# EAGLE design Stress Wheat bridge board (EAGLE 9.6.2)
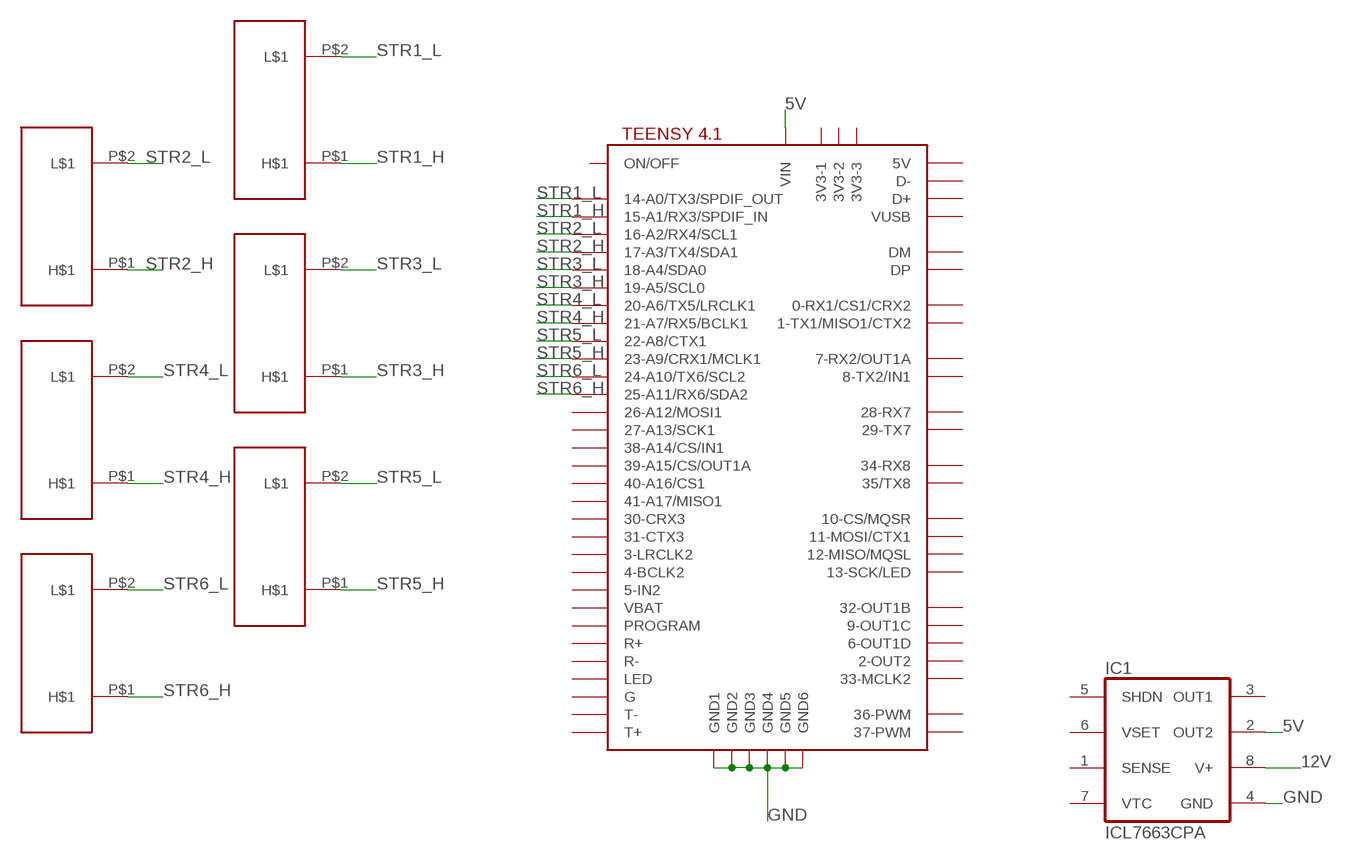
[diagram p0: schematic, sheet 1]

## Parts
IC1  ICL7663CPA  [DIL08]
U$1  STR_GAUGE  [STR_GAUGE]
U$2  STR_GAUGE  [STR_GAUGE]
U$3  TEENSY41  [TEENSY41]
U$4  STR_GAUGE  [STR_GAUGE]
U$5  STR_GAUGE  [STR_GAUGE]
U$6  STR_GAUGE  [STR_GAUGE]
U$7  STR_GAUGE  [STR_GAUGE]

## Nets
5V: IC1.2(OUT2) U$3.VIN
12V: IC1.8(V+)
GND: IC1.4(GND) U$3.GND1 U$3.GND2 U$3.GND3 U$3.GND4 U$3.GND5 U$3.GND6
STR1_H: U$1.P$1(H$1) U$3.15-A1/RX3/SPDIF_IN
STR1_L: U$1.P$2(L$1) U$3.14-A0/TX3/SPDIF_OUT
STR2_H: U$2.P$1(H$1) U$3.17-A3/TX4/SDA1
STR2_L: U$2.P$2(L$1) U$3.16-A2/RX4/SCL1
STR3_H: U$3.19-A5/SCL0 U$4.P$1(H$1)
STR3_L: U$3.18-A4/SDA0 U$4.P$2(L$1)
STR4_H: U$3.21-A7/RX5/BCLK1 U$5.P$1(H$1)
STR4_L: U$3.20-A6/TX5/LRCLK1 U$5.P$2(L$1)
STR5_H: U$3.23-A9/CRX1/MCLK1 U$6.P$1(H$1)
STR5_L: U$3.22-A8/CTX1 U$6.P$2(L$1)
STR6_H: U$3.25-A11/RX6/SDA2 U$7.P$1(H$1)
STR6_L: U$3.24-A10/TX6/SCL2 U$7.P$2(L$1)
Unconnected: IC1.1(SENSE) IC1.3(OUT1) IC1.5(SHDN) IC1.6(VSET) IC1.7(VTC) U$3.0-RX1/CS1/CRX2 U$3.1-TX1/MISO1/CTX2 U$3.2-OUT2 U$3.3-LRCLK2 U$3.3V3-1 U$3.3V3-2 U$3.3V3-3 U$3.4-BCLK2 U$3.5-IN2 U$3.6-OUT1D U$3.7-RX2/OUT1A U$3.8-TX2/IN2(8-TX2/IN1) U$3.9-OUT1C U$3.10-CS\MQSR(10-CS/MQSR) U$3.11-MOSI/CTX1 U$3.12-MISO/MQSL U$3.13-SCK/LED U$3.26-A12/MOSI1 U$3.27-A13/SCK1 U$3.28-RX7 U$3.29-TX7 U$3.30-CRX3 U$3.31-CTX3 U$3.32-OUT1B U$3.33-MCLK2 U$3.34-RX8 U$3.35-TX8(35/TX8) U$3.36-PWM U$3.37-PWM U$3.38-A14/CS/IN1 U$3.39-A15/CS/OUT1A U$3.40-A16/CS1 U$3.41-A17/MISO1 U$3.+5V(5V) U$3.D+ U$3.D- U$3.DM U$3.DP U$3.G U$3.LED U$3.ON/OFF U$3.PROGRAM U$3.R+ U$3.R- U$3.T+ U$3.T- U$3.VBAT U$3.VUSB

## Library data of the parts
IC1 = maxim:ICL7663CPA: Positive VOLTAGE REGULATOR; OC_FARNELL: unknown; OC_NEWARK: unknown
U$1 U$2 U$4-U$7 = F-E library custom components:STR_GAUGE
U$3 = teensy:TEENSY41

## Board
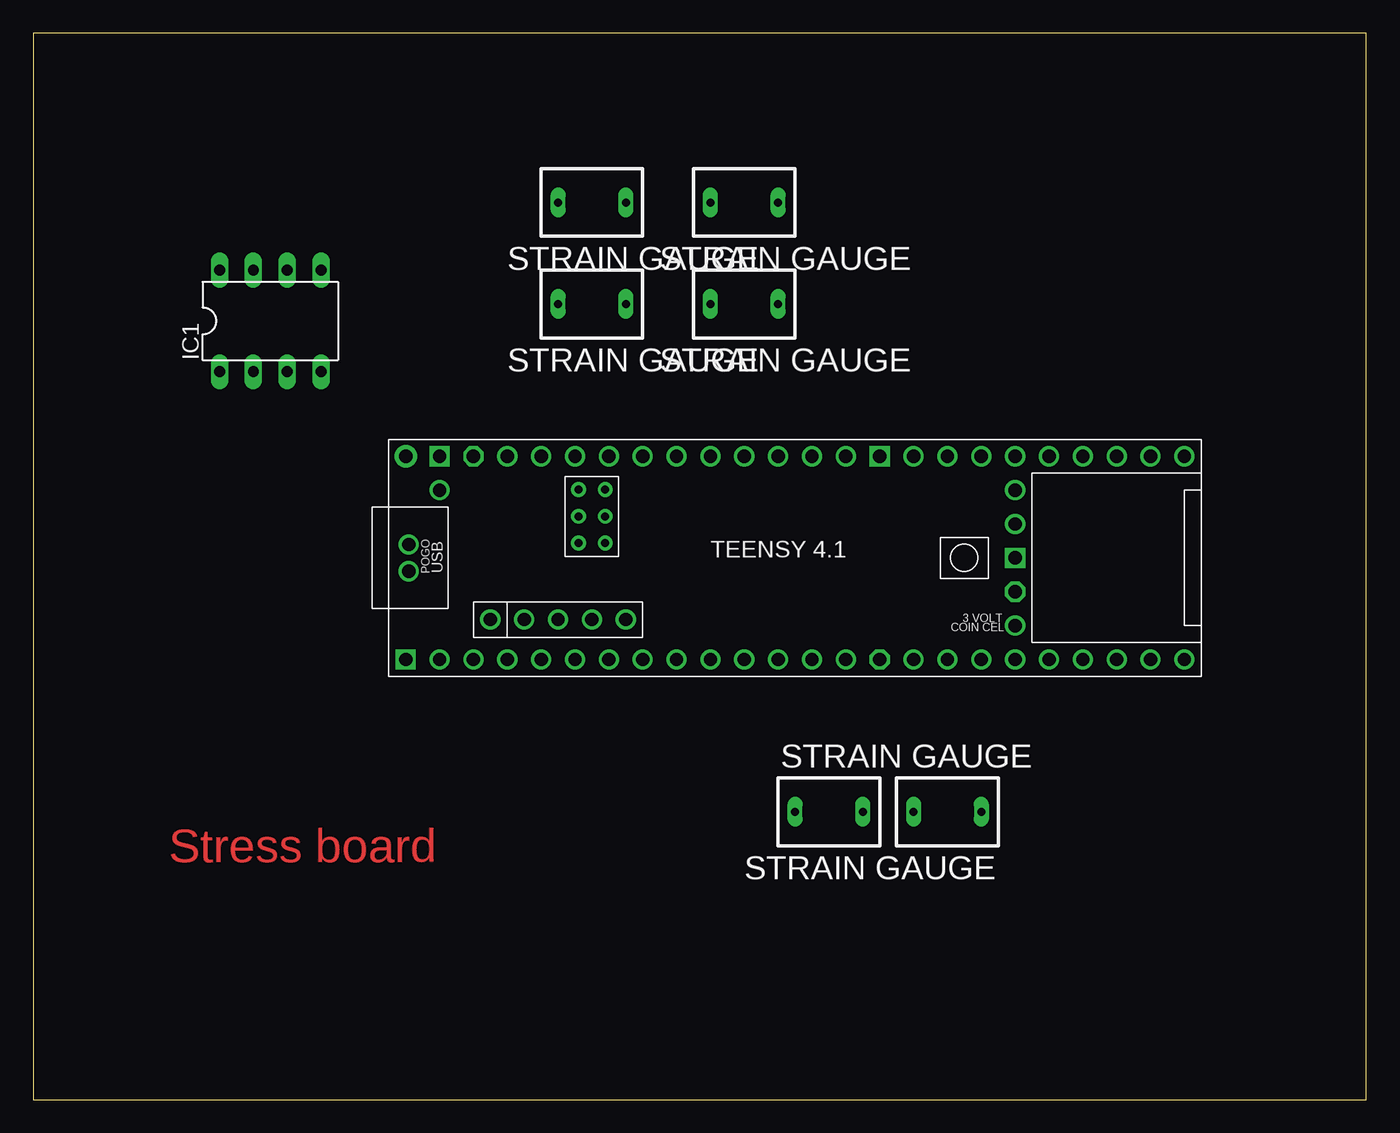
[diagram p1: board, top side]
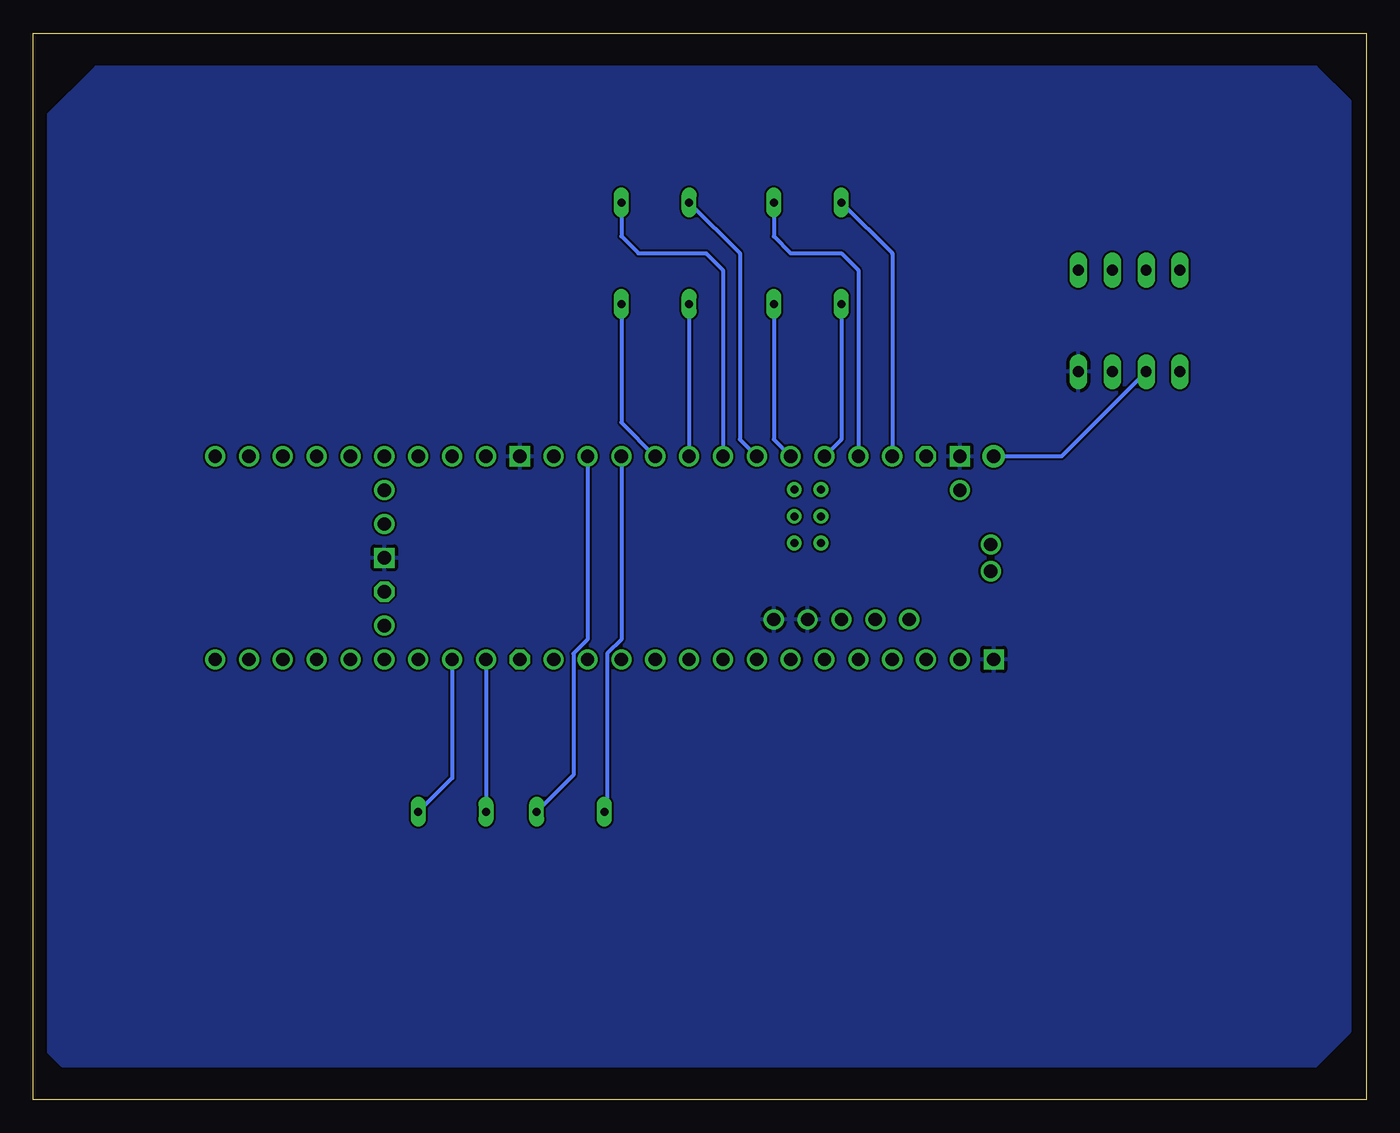
[diagram p2: board, bottom side, seen from below]

Size 100 x 80 mm. Coordinates in mm from the lower left corner, seen from the top.
Outline: 0,0 100,0 100,80 0,80 0,0
Copper layers (1*16): Top 0.035mm / dielectric 1.5mm / Bottom 0.035mm
Design rules "default": minimum track width 6mil, minimum drill 0.35mm, track to track 6mil, track to pad 6mil, pad to pad 6mil, via to via 6mil, smd to smd 6mil, copper to edge 40mil, drill to drill 6mil, minimum pad ring 10mil, minimum via ring 8mil, stop-mask expansion 4mil, vias tented up to drill 0mil, thermal gap 10mil

### Footprints (pad centres in the part's own frame; a part is rotated, then mirrored left to right if it is on the bottom)
DIL08 = drill 0.813 long: 1 -3.81,-3.81; 2 -1.27,-3.81; 3 1.27,-3.81; 4 3.81,-3.81; 5 3.81,3.81; 6 1.27,3.81; 7 -1.27,3.81; 8 -3.81,3.81
STR_GAUGE = drill 0.6 long: P$1 -2.54,0; P$2 2.54,0
TEENSY41 = drill 1: 0-RX1/CS1/CRX2 -27.94,-7.62; 1-TX1/MISO1/CTX2 -25.4,-7.62; 2-OUT2 -22.86,-7.62; 3-LRCLK2 -20.32,-7.62; 4-BCLK2 -17.78,-7.62; 5-IN2 -15.24,-7.62; 6-OUT1D -12.7,-7.62; 7-RX2/OUT1A -10.16,-7.62; 8-TX2/IN2 -7.62,-7.62; 9-OUT1C -5.08,-7.62; 10-CS\MQSR -2.54,-7.62; 11-MOSI/CTX1 0,-7.62; 12-MISO/MQSL 2.54,-7.62; 13-SCK/LED 2.54,7.62; 14-A0/TX3/SPDIF_OUT 0,7.62; 15-A1/RX3/SPDIF_IN -2.54,7.62; 16-A2/RX4/SCL1 -5.08,7.62; 17-A3/TX4/SDA1 -7.62,7.62; 18-A4/SDA0 -10.16,7.62; 19-A5/SCL0 -12.7,7.62; 20-A6/TX5/LRCLK1 -15.24,7.62; 21-A7/RX5/BCLK1 -17.78,7.62; 22-A8/CTX1 -20.32,7.62; 23-A9/CRX1/MCLK1 -22.86,7.62; 24-A10/TX6/SCL2 7.62,-7.62; 25-A11/RX6/SDA2 10.16,-7.62; 26-A12/MOSI1 12.7,-7.62; 27-A13/SCK1 15.24,-7.62; 28-RX7 17.78,-7.62; 29-TX7 20.32,-7.62; 30-CRX3 22.86,-7.62; 31-CTX3 25.4,-7.62; 32-OUT1B 27.94,-7.62; 33-MCLK2 27.94,7.62; 34-RX8 25.4,7.62; 35-TX8 22.86,7.62; 36-PWM 20.32,7.62; 37-PWM 17.78,7.62; 38-A14/CS/IN1 15.24,7.62; 39-A15/CS/OUT1A 12.7,7.62; 40-A16/CS1 10.16,7.62; 41-A17/MISO1 7.62,7.62; +5V -24.13,-4.62; D+ -30.25,-1; D- -30.25,1; DM -21.59,-4.62; DP -19.05,-4.62; GND4 -16.51,-4.62; GND5 -13.97,-4.62; ON/OFF 15.24,5.08; PROGRAM 15.24,2.54; VBAT 15.24,-5.08; VUSB -27.94,5.08 | drill 1 octagon: 3V3-1 5.08,-7.62; 3V3-2 15.24,-2.54; 3V3-3 -25.4,7.62 | drill 0.6: G -15.51,3.12; LED -17.51,3.12; R+ -17.51,5.12; R- -15.51,5.12; T+ -15.51,1.12; T- -17.51,1.12 | drill 1 square: GND1 -30.48,-7.62; GND2 15.24,0; GND3 5.08,7.62; GND6 -27.94,7.62 | drill 1 pad 1.676: VIN -30.48,7.62

### Placement (x,y rotation side)
IC1  17.78,58.42 0 top
U$1  59.69,21.59 0 top
U$2  53.34,59.69 0 top
U$3  58.42,40.64 0 top
U$4  53.34,67.31 0 top
U$5  41.91,59.69 0 top
U$6  41.91,67.31 0 top
U$7  68.58,21.59 180 top

### Tracks (layer width: path | path; a pad name or v marks a point on that pad's centre or on a via)
5V
  Bottom 0.305: IC1.2 22.86,48.26 U$3.VIN
GND
  pour Bottom: 1.27,5.08 3.81,2.54 97.79,2.54 99.06,3.81 99.06,73.66 95.25,77.47 3.81,77.47 1.27,74.93 1.27,73.66
STR1_H
  Bottom 0.305: U$3.15-A1/RX3/SPDIF_IN 55.88,34.52 56.94,33.46 56.94,21.8 U$1.P$1
STR1_L
  Bottom 0.305: U$3.14-A0/TX3/SPDIF_OUT 58.42,34.52 59.48,33.46 59.48,24.34 U$1.P$2
STR2_H
  Bottom 0.305: U$2.P$1 U$3.17-A3/TX4/SDA1
STR2_L
  Bottom 0.305: U$2.P$2 55.88,50.8 U$3.16-A2/RX4/SCL1
STR3_H
  Bottom 0.305: U$4.P$1 46.99,63.5 46.99,49.53 U$3.19-A5/SCL0
STR3_L
  Bottom 0.305: U$4.P$2 55.88,64.77 54.61,63.5 49.53,63.5 48.26,62.23 U$3.18-A4/SDA0
STR4_H
  Bottom 0.305: U$5.P$1 39.37,49.53 U$3.21-A7/RX5/BCLK1
STR4_L
  Bottom 0.305: U$5.P$2 44.45,49.53 U$3.20-A6/TX5/LRCLK1
STR5_H
  Bottom 0.305: U$6.P$1 35.56,63.5 U$3.23-A9/CRX1/MCLK1
STR5_L
  Bottom 0.305: U$6.P$2 44.45,64.77 43.18,63.5 39.37,63.5 38.1,62.23 U$3.22-A8/CTX1
STR6_H
  Bottom 0.305: U$3.25-A11/RX6/SDA2 68.58,24.13 U$7.P$1
STR6_L
  Bottom 0.305: U$3.24-A10/TX6/SCL2 U$7.P$2

### Text on the board
Top: Stress board